# EAGLE board musical-plant (EAGLE 7.6.0)
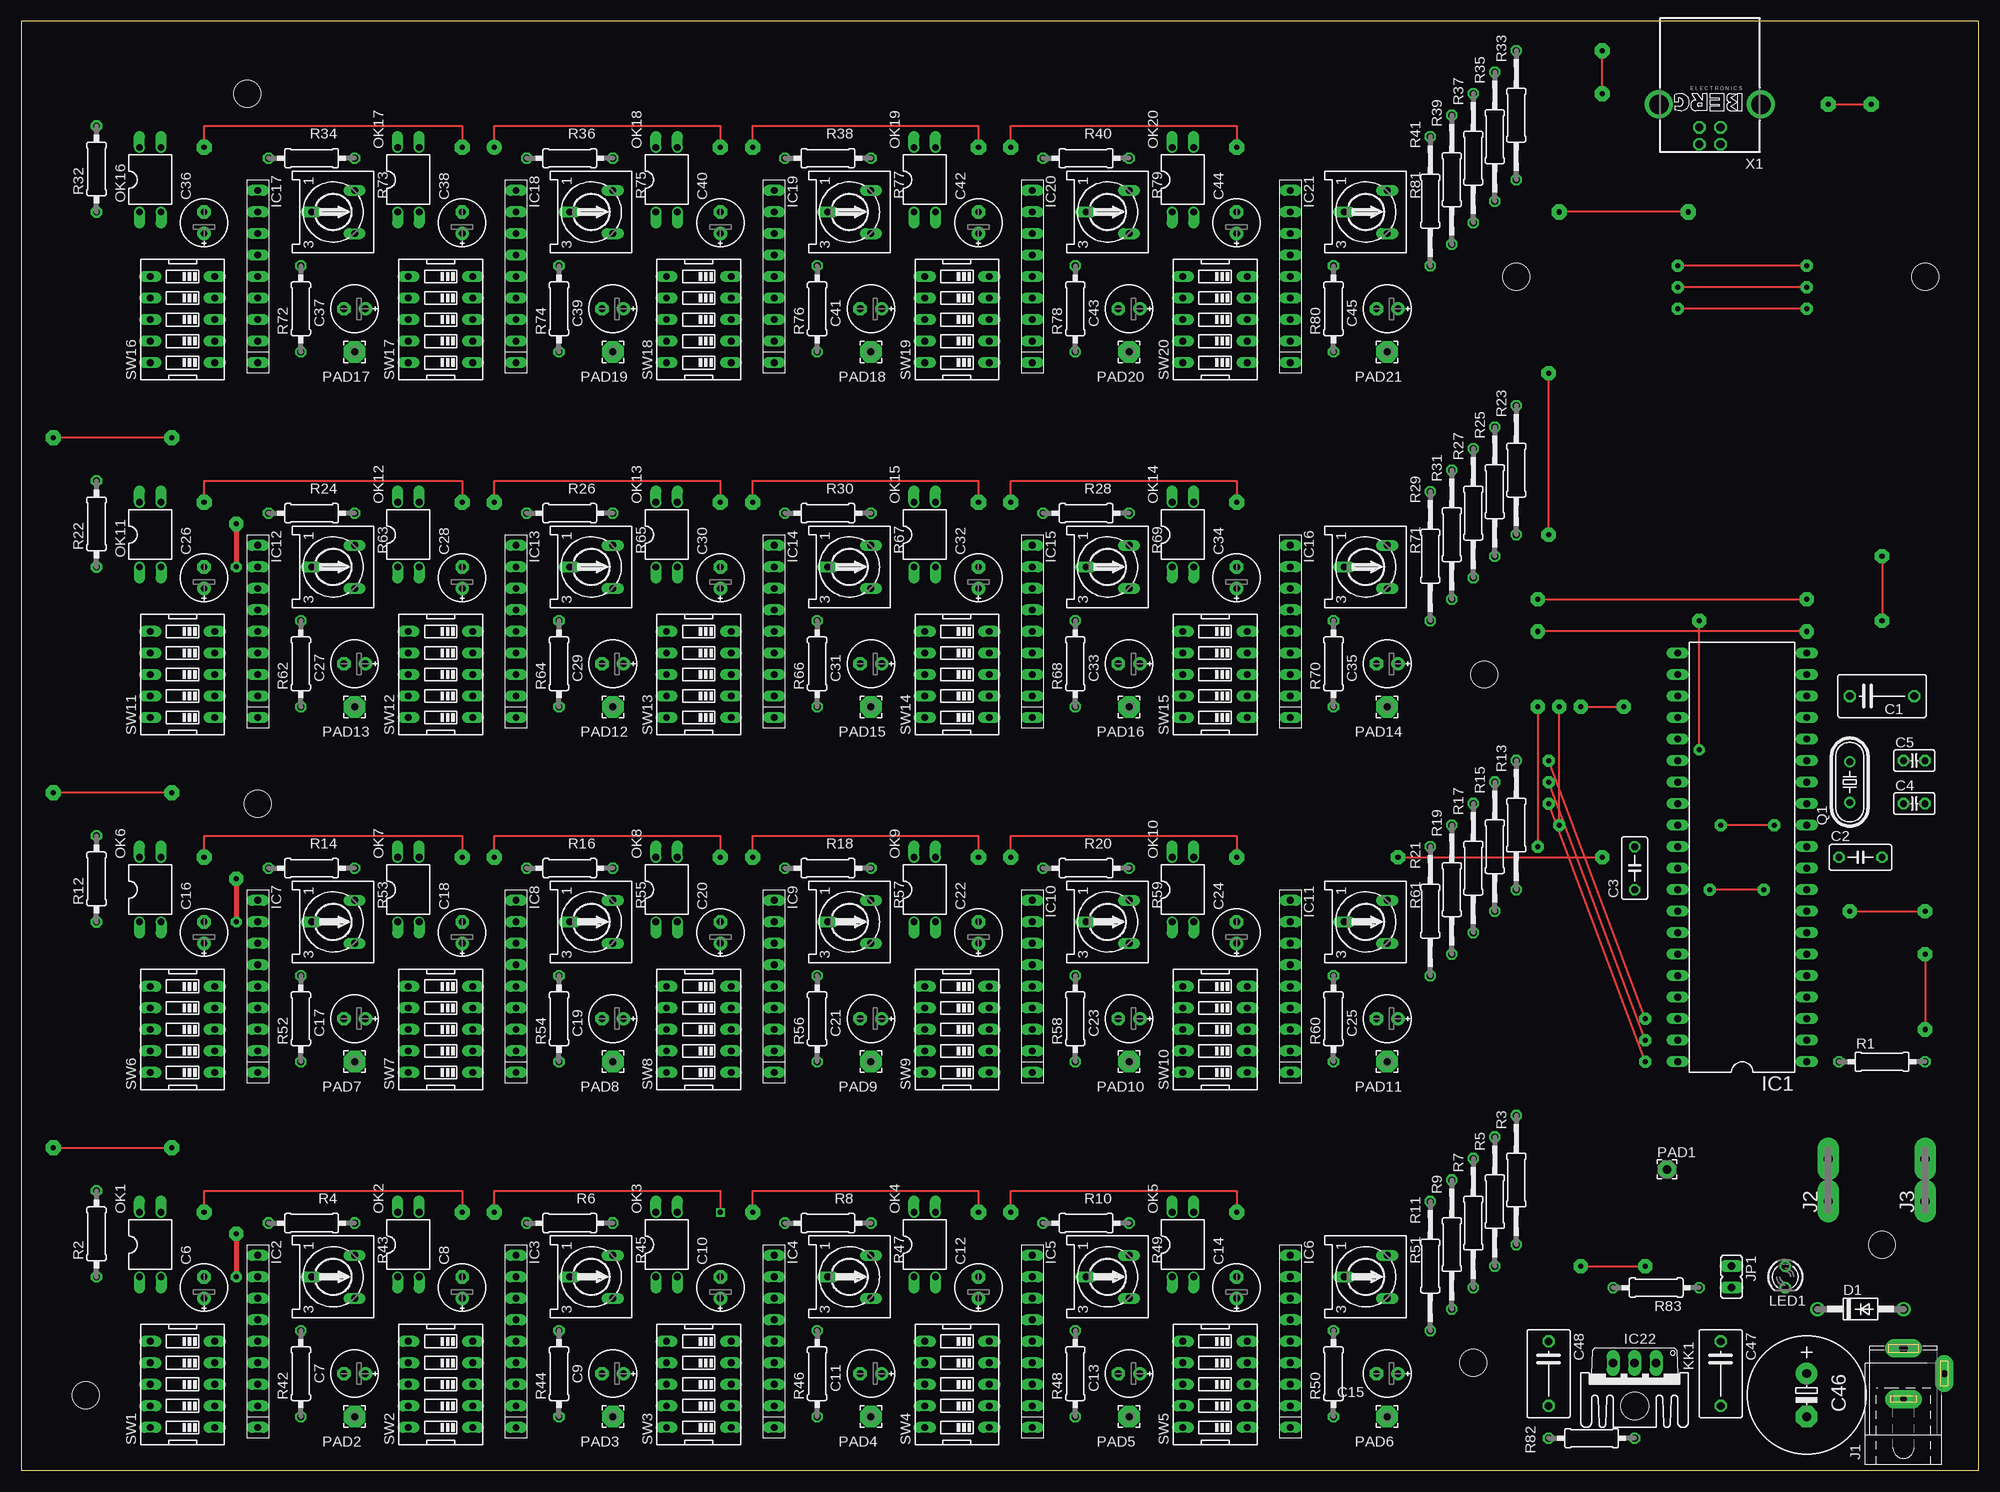
[diagram p2: board, top side]
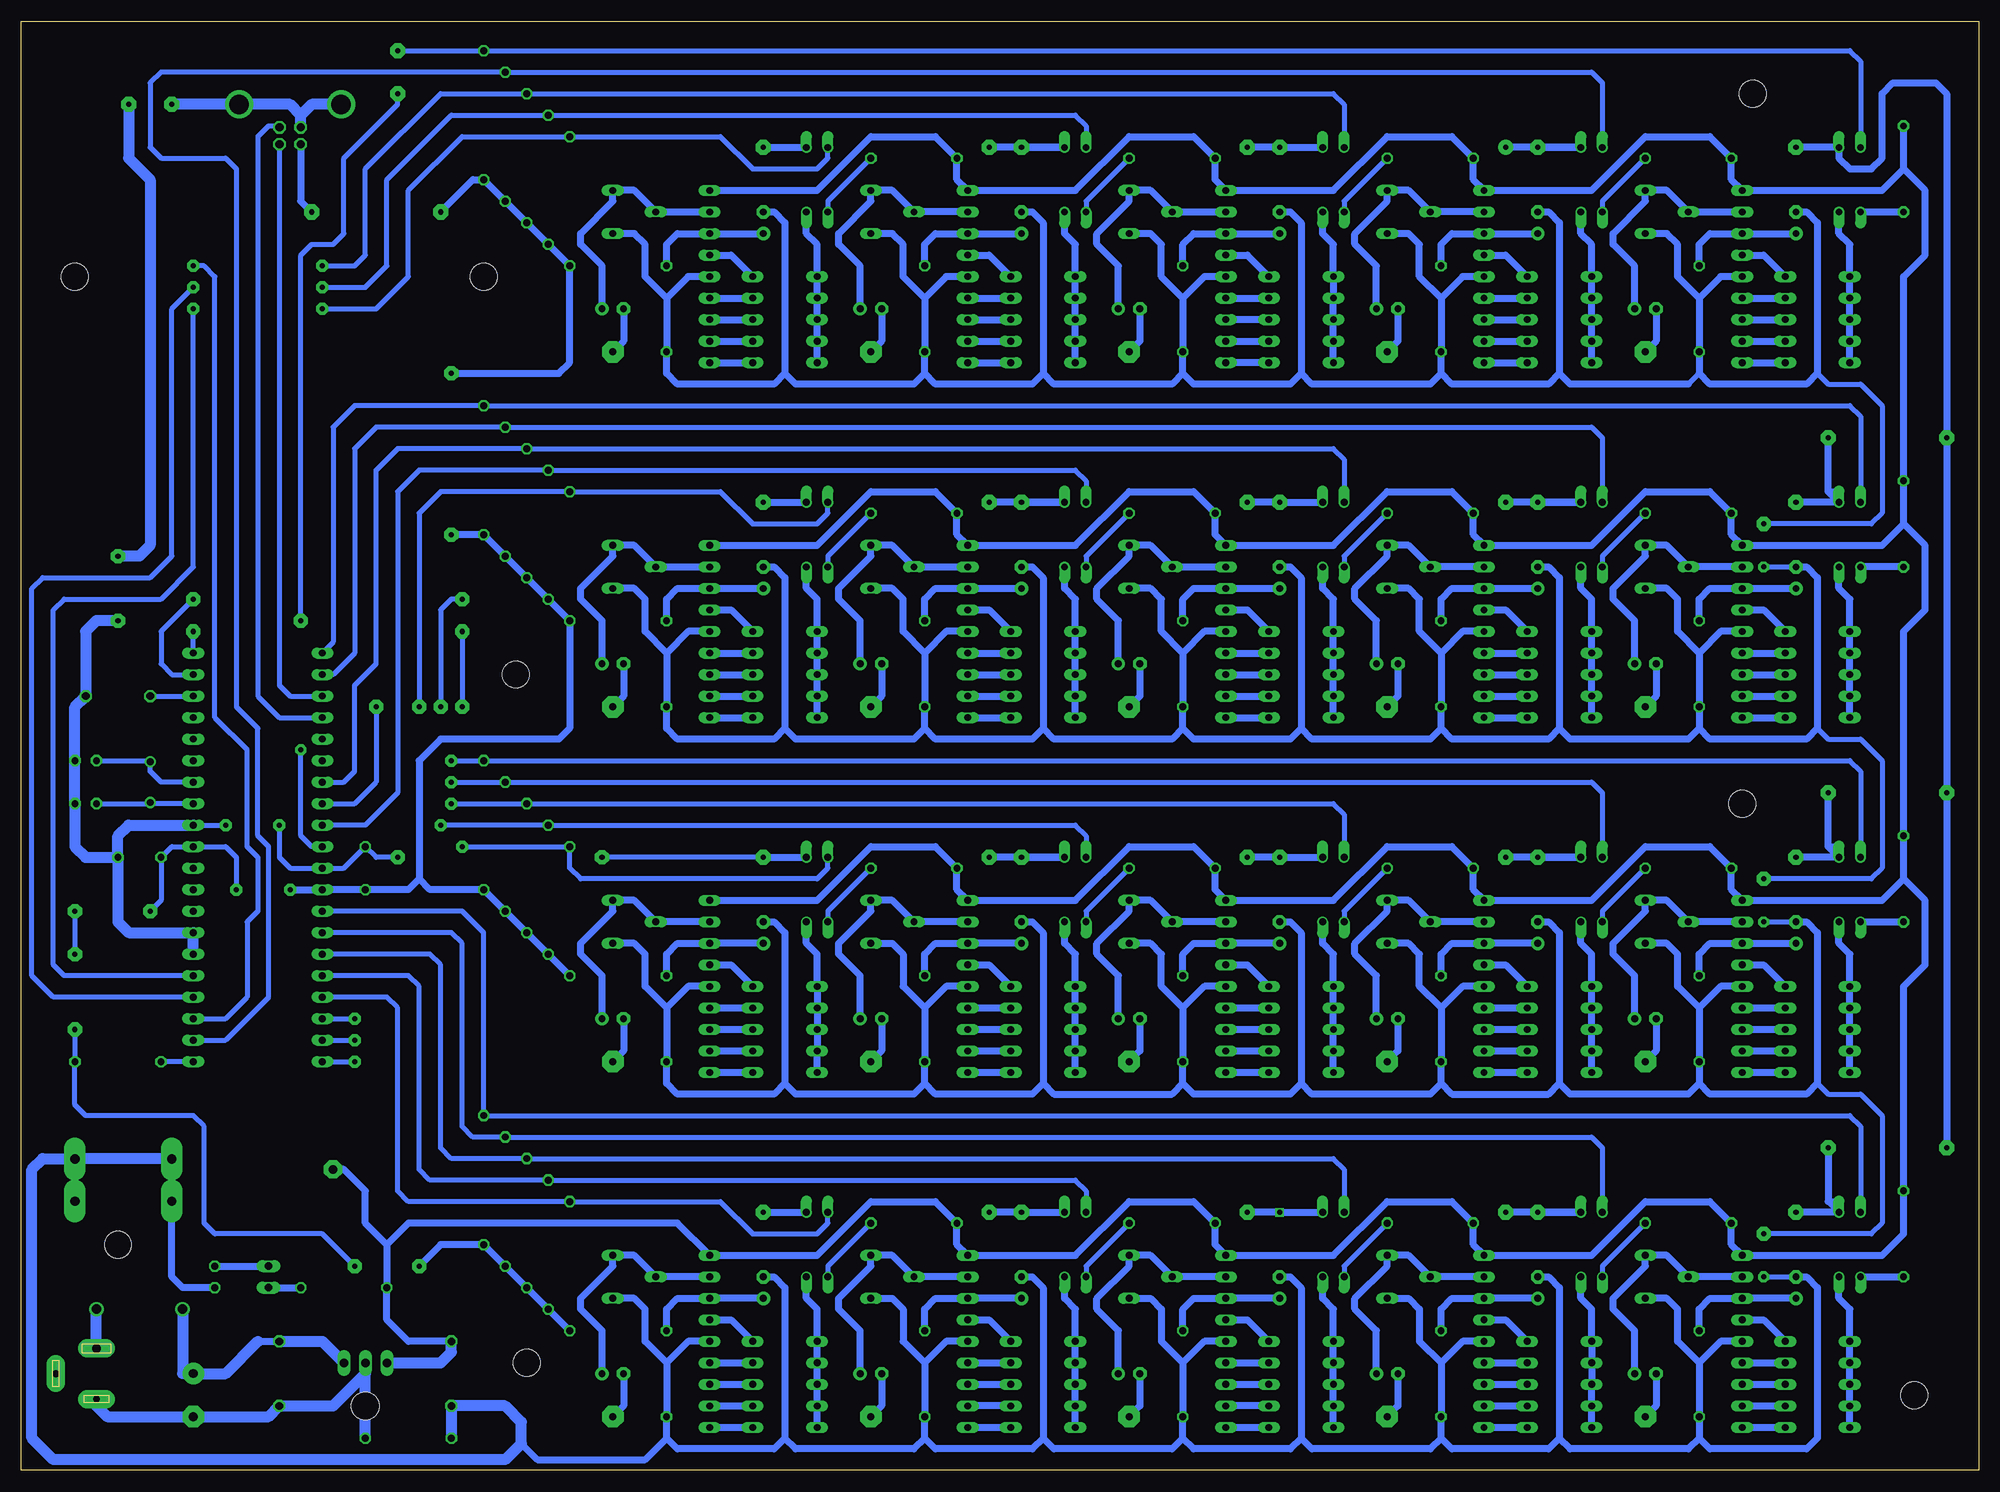
[diagram p3: board, bottom side, seen from below]

Size 231.12 x 171.12 mm. Coordinates in mm from the lower left corner, seen from the top.
Outline: 0,0 231.12,0 231.12,171.12 0,171.12 0,0
Copper layers (1*16): Top 0.035mm / dielectric 1.5mm / Bottom 0.035mm
Design rules "default": minimum track width 10mil, minimum drill 24mil, track to track 8mil, track to pad 8mil, pad to pad 8mil, via to via 8mil, smd to smd 8mil, copper to edge 40mil, drill to drill 8mil, minimum pad ring 10mil, minimum via ring 8mil, stop-mask expansion 4mil, vias tented up to drill 0mil, thermal gap 10mil
Holes 3.2 mm at 224.79,140.97 26.67,162.56 219.71,26.67 7.62,8.89 27.94,78.74 172.72,93.98 176.53,140.97 171.45,12.7

## Footprints (pad centres in the part's own frame; a part is rotated, then mirrored left to right if it is on the bottom)
C075-052X106 = drill 0.914 octagon: 1 -3.81,0; 2 3.81,0
C050-030X075 = drill 0.813 octagon: 1 -2.54,0; 2 2.54,0
C025-025X050 = drill 0.813 octagon: 1 -1.27,0; 2 1.27,0
E2,5-6E = drill 0.813 pad 1.575: + -1.27,0 | drill 0.813 pad 1.575 octagon: - 1.27,0
E5-13 = drill 1.016 pad 2.54: + -2.54,0 | drill 1.016 pad 2.54 octagon: - 2.54,0
DO41-10 = drill 1.118: A 5.08,0; C -5.08,0
DIL40 = drill 0.813 long: 1 -24.13,-7.62; 2 -21.59,-7.62; 3 -19.05,-7.62; 4 -16.51,-7.62; 5 -13.97,-7.62; 6 -11.43,-7.62; 7 -8.89,-7.62; 8 -6.35,-7.62; 9 -3.81,-7.62; 10 -1.27,-7.62; 11 1.27,-7.62; 12 3.81,-7.62; 13 6.35,-7.62; 14 8.89,-7.62; 15 11.43,-7.62; 16 13.97,-7.62; 17 16.51,-7.62; 18 19.05,-7.62; 19 21.59,-7.62; 20 24.13,-7.62; 21 24.13,7.62; 22 21.59,7.62; 23 19.05,7.62; 24 16.51,7.62; 25 13.97,7.62; 26 11.43,7.62; 27 8.89,7.62; 28 6.35,7.62; 29 3.81,7.62; 30 1.27,7.62; 31 -1.27,7.62; 32 -3.81,7.62; 33 -6.35,7.62; 34 -8.89,7.62; 35 -11.43,7.62; 36 -13.97,7.62; 37 -16.51,7.62; 38 -19.05,7.62; 39 -21.59,7.62; 40 -24.13,7.62
SIP-9 = drill 0.813 long: 1 -10.16,0; 2 -7.62,0; 3 -5.08,0; 4 -2.54,0; 5 0,0; 6 2.54,0; 7 5.08,0; 8 7.62,0; 9 10.16,0
TO220V = drill 1.016 long: 1 -2.54,-2.54; 2 0,-2.54; 3 2.54,-2.54
SPC4078 = drill 0.8 pad 2.184 long: 1 -3,0; 2 0,-4.8 | drill 1 pad 2.184 long: 3 3,0
F061.080 = drill 1.1 pad 2.54 long: 1A -2.5,0; 1B 2.5,0
JP1 = drill 0.914 long: 1 0,-1.27; 2 0,1.27
SK95-2M3 = hole 3.302: 0,2.54
LED3MM = drill 0.813 octagon: A -1.27,0; K 1.27,0
DIL04 = drill 0.813 offset: 1 -1.27,-3.81; 2 1.27,-3.81; 3 1.27,3.81; 4 -1.27,3.81
2,15/1,0 = drill 1.016 pad 2.159 octagon: 1 0,0
2,54/0,8 = drill 0.813 pad 2.54 octagon: 1 0,0
HC49/S = drill 0.813: 1 -2.413,0; 2 2.413,0
0207/10 = drill 0.813 octagon: 1 -5.08,0; 2 5.08,0
0207/15 = drill 0.813 octagon: 1 -7.62,0; 2 7.62,0
RS3 = drill 0.813 long: A -2.54,2.54; E 2.54,2.54; S 0,-2.54
EDG-05 = drill 0.813 long: 1 -5.08,-3.81; 2 -2.54,-3.81; 3 0,-3.81; 4 2.54,-3.81; 5 5.08,-3.81; 6 5.08,3.81; 7 2.54,3.81; 8 0,3.81; 9 -2.54,3.81; 10 -5.08,3.81
PN61729-S = drill 0.95 octagon: 1 1.25,4.71; 2 -1.25,4.71; 3 -1.25,2.71; 4 1.25,2.71 | drill 2.3 pad 2.9: S1 -6.02,0; S2 6.02,0

## Placement (x,y rotation side)
C1  0.22MFD/25V  [C075-052X106]  219.71,91.44 0 top
C2  0.1MFD/16V  [C050-030X075]  217.17,72.39 0 top
C3  0.1MFD/16V  [C050-030X075]  190.5,71.12 90 top
C4  15pF  [C025-025X050]  223.52,78.74 0 top
C5  15pF  [C025-025X050]  223.52,83.82 0 top
C6  10MFD/16V  [E2,5-6E]  21.59,21.59 90 top
C7  2.2MFD/16V  [E2,5-6E]  39.37,11.43 180 top
C8  10MFD/16V  [E2,5-6E]  52.07,21.59 90 top
C9  2.2MFD/16V  [E2,5-6E]  69.85,11.43 180 top
C10  10MFD/16V  [E2,5-6E]  82.55,21.59 90 top
C11  2.2MFD/16V  [E2,5-6E]  100.33,11.43 180 top
C12  10MFD/16V  [E2,5-6E]  113.03,21.59 90 top
C13  2.2MFD/16V  [E2,5-6E]  130.81,11.43 180 top
C14  10MFD/16V  [E2,5-6E]  143.51,21.59 90 top
C15  2.2MFD/16V  [E2,5-6E]  161.29,11.43 180 top
C16  10MFD/16V  [E2,5-6E]  21.59,63.5 90 top
C17  2.2MFD/16V  [E2,5-6E]  39.37,53.34 180 top
C18  10MFD/16V  [E2,5-6E]  52.07,63.5 90 top
C19  2.2MFD/16V  [E2,5-6E]  69.85,53.34 180 top
C20  10MFD/16V  [E2,5-6E]  82.55,63.5 90 top
C21  2.2MFD/16V  [E2,5-6E]  100.33,53.34 180 top
C22  10MFD/16V  [E2,5-6E]  113.03,63.5 90 top
C23  2.2MFD/16V  [E2,5-6E]  130.81,53.34 180 top
C24  10MFD/16V  [E2,5-6E]  143.51,63.5 90 top
C25  2.2MFD/16V  [E2,5-6E]  161.29,53.34 180 top
C26  10MFD/16V  [E2,5-6E]  21.59,105.41 90 top
C27  2.2MFD/16V  [E2,5-6E]  39.37,95.25 180 top
C28  10MFD/16V  [E2,5-6E]  52.07,105.41 90 top
C29  2.2MFD/16V  [E2,5-6E]  69.85,95.25 180 top
C30  10MFD/16V  [E2,5-6E]  82.55,105.41 90 top
C31  2.2MFD/16V  [E2,5-6E]  100.33,95.25 180 top
C32  10MFD/16V  [E2,5-6E]  113.03,105.41 90 top
C33  2.2MFD/16V  [E2,5-6E]  130.81,95.25 180 top
C34  10MFD/16V  [E2,5-6E]  143.51,105.41 90 top
C35  2.2MFD/16V  [E2,5-6E]  161.29,95.25 180 top
C36  10MFD/16V  [E2,5-6E]  21.59,147.32 90 top
C37  2.2MFD/16V  [E2,5-6E]  39.37,137.16 180 top
C38  10MFD/16V  [E2,5-6E]  52.07,147.32 90 top
C39  2.2MFD/16V  [E2,5-6E]  69.85,137.16 180 top
C40  10MFD/16V  [E2,5-6E]  82.55,147.32 90 top
C41  2.2MFD/16V  [E2,5-6E]  100.33,137.16 180 top
C42  10MFD/16V  [E2,5-6E]  113.03,147.32 90 top
C43  2.2MFD/16V  [E2,5-6E]  130.81,137.16 180 top
C44  10MFD/16V  [E2,5-6E]  143.51,147.32 90 top
C45  2.2MFD/16V  [E2,5-6E]  161.29,137.16 180 top
C46  1000MFD/25V  [E5-13]  210.82,8.89 270 top
C47  0.1MFD/25V  [C075-052X106]  200.66,11.43 270 top
C48  0.1MFD/25V  [C075-052X106]  180.34,11.43 270 top
D1  1N4004  [DO41-10]  217.17,19.05 0 top
IC1  PIC18F4550  [DIL40]  203.2,72.39 90 top
IC2  KA2284  [SIP-9]  27.94,15.24 90 top
IC3  KA2284  [SIP-9]  58.42,15.24 90 top
IC4  KA2284  [SIP-9]  88.9,15.24 90 top
IC5  KA2284  [SIP-9]  119.38,15.24 90 top
IC6  KA2284  [SIP-9]  149.86,15.24 90 top
IC7  KA2284  [SIP-9]  27.94,57.15 90 top
IC8  KA2284  [SIP-9]  58.42,57.15 90 top
IC9  KA2284  [SIP-9]  88.9,57.15 90 top
IC10  KA2284  [SIP-9]  119.38,57.15 90 top
IC11  KA2284  [SIP-9]  149.86,57.15 90 top
IC12  KA2284  [SIP-9]  27.94,99.06 90 top
IC13  KA2284  [SIP-9]  58.42,99.06 90 top
IC14  KA2284  [SIP-9]  88.9,99.06 90 top
IC15  KA2284  [SIP-9]  119.38,99.06 90 top
IC16  KA2284  [SIP-9]  149.86,99.06 90 top
IC17  KA2284  [SIP-9]  27.94,140.97 90 top
IC18  KA2284  [SIP-9]  58.42,140.97 90 top
IC19  KA2284  [SIP-9]  88.9,140.97 90 top
IC20  KA2284  [SIP-9]  119.38,140.97 90 top
IC21  KA2284  [SIP-9]  149.86,140.97 90 top
IC22  7809TV  [TO220V]  190.5,10.16 180 top
J1  DC-IN  [SPC4078]  222.25,11.43 90 top
J2  GND-PIN1  [F061.080]  213.36,34.29 90 top
J3  GND-PIN2  [F061.080]  224.79,34.29 90 top
JP1  [JP1]  201.93,22.86 180 top
KK1  SK95-2M3  [SK95-2M3]  190.5,10.16 180 top
LED1  POWER-IND  [LED3MM]  208.28,22.86 270 top
OK1  PC817  [DIL04]  15.24,26.67 0 top
OK2  PC817  [DIL04]  45.72,26.67 0 top
OK3  PC817  [DIL04]  76.2,26.67 0 top
OK4  PC817  [DIL04]  106.68,26.67 0 top
OK5  PC817  [DIL04]  137.16,26.67 0 top
OK6  PC817  [DIL04]  15.24,68.58 0 top
OK7  PC817  [DIL04]  45.72,68.58 0 top
OK8  PC817  [DIL04]  76.2,68.58 0 top
OK9  PC817  [DIL04]  106.68,68.58 0 top
OK10  PC817  [DIL04]  137.16,68.58 0 top
OK11  PC817  [DIL04]  15.24,110.49 0 top
OK12  PC817  [DIL04]  45.72,110.49 0 top
OK13  PC817  [DIL04]  76.2,110.49 0 top
OK14  PC817  [DIL04]  137.16,110.49 0 top
OK15  PC817  [DIL04]  106.68,110.49 0 top
OK16  PC817  [DIL04]  15.24,152.4 0 top
OK17  PC817  [DIL04]  45.72,152.4 0 top
OK18  PC817  [DIL04]  76.2,152.4 0 top
OK19  PC817  [DIL04]  106.68,152.4 0 top
OK20  PC817  [DIL04]  137.16,152.4 0 top
PAD1  TP-9V  [2,15/1,0]  194.31,35.56 0 top
PAD2  WIREPAD2,54/0,8  [2,54/0,8]  39.37,6.35 0 top
PAD3  WIREPAD2,54/0,8  [2,54/0,8]  69.85,6.35 0 top
PAD4  WIREPAD2,54/0,8  [2,54/0,8]  100.33,6.35 0 top
PAD5  WIREPAD2,54/0,8  [2,54/0,8]  130.81,6.35 0 top
PAD6  WIREPAD2,54/0,8  [2,54/0,8]  161.29,6.35 0 top
PAD7  WIREPAD2,54/0,8  [2,54/0,8]  39.37,48.26 0 top
PAD8  WIREPAD2,54/0,8  [2,54/0,8]  69.85,48.26 0 top
PAD9  WIREPAD2,54/0,8  [2,54/0,8]  100.33,48.26 0 top
PAD10  WIREPAD2,54/0,8  [2,54/0,8]  130.81,48.26 0 top
PAD11  WIREPAD2,54/0,8  [2,54/0,8]  161.29,48.26 0 top
PAD12  WIREPAD2,54/0,8  [2,54/0,8]  69.85,90.17 0 top
PAD13  WIREPAD2,54/0,8  [2,54/0,8]  39.37,90.17 0 top
PAD14  WIREPAD2,54/0,8  [2,54/0,8]  161.29,90.17 0 top
PAD15  WIREPAD2,54/0,8  [2,54/0,8]  100.33,90.17 0 top
PAD16  WIREPAD2,54/0,8  [2,54/0,8]  130.81,90.17 0 top
PAD17  WIREPAD2,54/0,8  [2,54/0,8]  39.37,132.08 0 top
PAD18  WIREPAD2,54/0,8  [2,54/0,8]  100.33,132.08 0 top
PAD19  WIREPAD2,54/0,8  [2,54/0,8]  69.85,132.08 0 top
PAD20  WIREPAD2,54/0,8  [2,54/0,8]  130.81,132.08 0 top
PAD21  WIREPAD2,54/0,8  [2,54/0,8]  161.29,132.08 0 top
Q1  20.000MHz  [HC49/S]  215.9,81.28 90 top
R1  22K  [0207/10]  219.71,48.26 0 top
R2  1K  [0207/10]  8.89,27.94 90 top
R3  22K  [0207/15]  176.53,34.29 270 top
R4  1K  [0207/10]  34.29,29.21 180 top
R5  22K  [0207/15]  173.99,31.75 270 top
R6  1K  [0207/10]  64.77,29.21 180 top
R7  22K  [0207/15]  171.45,29.21 270 top
R8  1K  [0207/10]  95.25,29.21 180 top
R9  22K  [0207/15]  168.91,26.67 270 top
R10  1K  [0207/10]  125.73,29.21 180 top
R11  22K  [0207/15]  166.37,24.13 270 top
R12  1K  [0207/10]  8.89,69.85 90 top
R13  22K  [0207/15]  176.53,76.2 270 top
R14  1K  [0207/10]  34.29,71.12 180 top
R15  22K  [0207/15]  173.99,73.66 270 top
R16  1K  [0207/10]  64.77,71.12 180 top
R17  22K  [0207/15]  171.45,71.12 270 top
R18  1K  [0207/10]  95.25,71.12 180 top
R19  22K  [0207/15]  168.91,68.58 270 top
R20  1K  [0207/10]  125.73,71.12 180 top
R21  22K  [0207/15]  166.37,66.04 270 top
R22  1K  [0207/10]  8.89,111.76 90 top
R23  22K  [0207/15]  176.53,118.11 270 top
R24  1K  [0207/10]  34.29,113.03 180 top
R25  22K  [0207/15]  173.99,115.57 270 top
R26  1K  [0207/10]  64.77,113.03 180 top
R27  22K  [0207/15]  171.45,113.03 270 top
R28  1K  [0207/10]  125.73,113.03 180 top
R29  22K  [0207/15]  166.37,107.95 270 top
R30  1K  [0207/10]  95.25,113.03 180 top
R31  22K  [0207/15]  168.91,110.49 270 top
R32  1K  [0207/10]  8.89,153.67 90 top
R33  22K  [0207/15]  176.53,160.02 270 top
R34  1K  [0207/10]  34.29,154.94 180 top
R35  22K  [0207/15]  173.99,157.48 270 top
R36  1K  [0207/10]  64.77,154.94 180 top
R37  22K  [0207/15]  171.45,154.94 270 top
R38  1K  [0207/10]  95.25,154.94 180 top
R39  22K  [0207/15]  168.91,152.4 270 top
R40  1K  [0207/10]  125.73,154.94 180 top
R41  22K  [0207/15]  166.37,149.86 270 top
R42  10K  [0207/10]  33.02,11.43 90 top
R43  470K  [RS3]  36.83,22.86 270 top
R44  10K  [0207/10]  63.5,11.43 90 top
R45  470K  [RS3]  67.31,22.86 270 top
R46  10K  [0207/10]  93.98,11.43 90 top
R47  470K  [RS3]  97.79,22.86 270 top
R48  10K  [0207/10]  124.46,11.43 90 top
R49  470K  [RS3]  128.27,22.86 270 top
R50  10K  [0207/10]  154.94,11.43 90 top
R51  470K  [RS3]  158.75,22.86 270 top
R52  10K  [0207/10]  33.02,53.34 90 top
R53  470K  [RS3]  36.83,64.77 270 top
R54  10K  [0207/10]  63.5,53.34 90 top
R55  470K  [RS3]  67.31,64.77 270 top
R56  10K  [0207/10]  93.98,53.34 90 top
R57  470K  [RS3]  97.79,64.77 270 top
R58  10K  [0207/10]  124.46,53.34 90 top
R59  470K  [RS3]  128.27,64.77 270 top
R60  10K  [0207/10]  154.94,53.34 90 top
R61  470K  [RS3]  158.75,64.77 270 top
R62  10K  [0207/10]  33.02,95.25 90 top
R63  470K  [RS3]  36.83,106.68 270 top
R64  10K  [0207/10]  63.5,95.25 90 top
R65  470K  [RS3]  67.31,106.68 270 top
R66  10K  [0207/10]  93.98,95.25 90 top
R67  470K  [RS3]  97.79,106.68 270 top
R68  10K  [0207/10]  124.46,95.25 90 top
R69  470K  [RS3]  128.27,106.68 270 top
R70  10K  [0207/10]  154.94,95.25 90 top
R71  470K  [RS3]  158.75,106.68 270 top
R72  10K  [0207/10]  33.02,137.16 90 top
R73  470K  [RS3]  36.83,148.59 270 top
R74  10K  [0207/10]  63.5,137.16 90 top
R75  470K  [RS3]  67.31,148.59 270 top
R76  10K  [0207/10]  93.98,137.16 90 top
R77  470K  [RS3]  97.79,148.59 270 top
R78  10K  [0207/10]  124.46,137.16 90 top
R79  470K  [RS3]  128.27,148.59 270 top
R80  10K  [0207/10]  154.94,137.16 90 top
R81  470K  [RS3]  158.75,148.59 270 top
R82  0R  [0207/10]  185.42,3.81 0 top
R83  1K  [0207/10]  193.04,21.59 180 top
SW1  [EDG-05]  19.05,10.16 90 top
SW2  [EDG-05]  49.53,10.16 90 top
SW3  [EDG-05]  80.01,10.16 90 top
SW4  [EDG-05]  110.49,10.16 90 top
SW5  [EDG-05]  140.97,10.16 90 top
SW6  [EDG-05]  19.05,52.07 90 top
SW7  [EDG-05]  49.53,52.07 90 top
SW8  [EDG-05]  80.01,52.07 90 top
SW9  [EDG-05]  110.49,52.07 90 top
SW10  [EDG-05]  140.97,52.07 90 top
SW11  [EDG-05]  19.05,93.98 90 top
SW12  [EDG-05]  49.53,93.98 90 top
SW13  [EDG-05]  80.01,93.98 90 top
SW14  [EDG-05]  110.49,93.98 90 top
SW15  [EDG-05]  140.97,93.98 90 top
SW16  [EDG-05]  19.05,135.89 90 top
SW17  [EDG-05]  49.53,135.89 90 top
SW18  [EDG-05]  80.01,135.89 90 top
SW19  [EDG-05]  110.49,135.89 90 top
SW20  [EDG-05]  140.97,135.89 90 top
X1  PN61729-S  [PN61729-S]  199.39,161.29 180 top

## Tracks (layer width: path | path; a pad name or v marks a point on that pad's centre or on a via)
+5V  (via drill 0.6 pad 1.42, 0.6 pad 1.68, 0.6 pad 1.78)
  Top 0.254: v215.9,66.04 v224.79,66.04 | v224.79,60.96 v224.79,52.07 | v205.74,68.58 v199.39,68.58 | v180.34,110.49 v180.34,129.54 | v184.15,24.13 v191.77,24.13 | v196.85,148.59 v181.61,148.59
  Bottom 0.61: v215.9,66.04 214.63,67.31 C2.1 213.36,73.66 IC1.11 207.01,73.66 205.74,72.39 v205.74,68.58 | v224.79,66.04 v224.79,60.96 | v224.79,52.07 R1.2 224.79,43.18 223.52,41.91 210.82,41.91 209.55,40.64 209.55,29.21 208.28,27.94 195.58,27.94 v191.77,24.13
  Bottom 0.813: R21.2 R19.2 R17.2 R15.2 R13.2 182.88,68.58 184.15,69.85 | R11.2 R9.2 R7.2 R5.2 R3.2 181.61,26.67 v184.15,24.13 | v199.39,68.58 IC1.32 C3.1 185.42,68.58 184.15,69.85 | 184.15,69.85 184.15,83.82 181.61,86.36 167.64,86.36 166.37,87.63 R29.2 R31.2 R27.2 R25.2 R23.2 v180.34,110.49 | v180.34,129.54 167.64,129.54 166.37,130.81 R41.2 R39.2 R37.2 R35.2 R33.2 177.8,152.4 v181.61,148.59 | X1.1 198.14,149.88 v196.85,148.59
+9V
  Bottom 0.813: IC11.9 137.16,67.31 130.81,73.66 123.19,73.66 R20.2 120.65,68.58 IC10.9 106.68,67.31 100.33,73.66 92.71,73.66 R18.2 90.17,68.58 IC9.9 76.2,67.31 69.85,73.66 62.23,73.66 R16.2 59.69,68.58 IC8.9 45.72,67.31 39.37,73.66 31.75,73.66 R14.2 29.21,68.58 IC7.9 11.43,67.31 8.89,69.85 | IC16.9 137.16,109.22 130.81,115.57 123.19,115.57 R28.2 120.65,110.49 IC15.9 106.68,109.22 100.33,115.57 92.71,115.57 R30.2 90.17,110.49 IC14.9 76.2,109.22 69.85,115.57 62.23,115.57 R26.2 59.69,110.49 IC13.9 45.72,109.22 39.37,115.57 31.75,115.57 R24.2 29.21,110.49 IC12.9 11.43,109.22 8.89,111.76 | IC21.9 137.16,151.13 130.81,157.48 123.19,157.48 R40.2 120.65,152.4 IC20.9 106.68,151.13 100.33,157.48 92.71,157.48 R38.2 90.17,152.4 IC19.9 76.2,151.13 69.85,157.48 62.23,157.48 R36.2 59.69,152.4 IC18.9 45.72,151.13 39.37,157.48 31.75,157.48 R34.2 29.21,152.4 IC17.9 11.43,151.13 8.89,153.67 | 8.89,69.85 R12.2 8.89,99.06 6.35,101.6 6.35,109.22 8.89,111.76 | 8.89,111.76 R22.2 8.89,140.97 6.35,143.51 6.35,151.13 8.89,153.67 | 8.89,153.67 R32.2 | 8.89,69.85 6.35,67.31 6.35,59.69 8.89,57.15 R2.2 8.89,27.94 11.43,25.4 IC2.9 29.21,26.67 R4.2 31.75,31.75 39.37,31.75 45.72,25.4 IC3.9 59.69,26.67 R6.2 62.23,31.75 69.85,31.75 76.2,25.4 IC4.9 90.17,26.67 R8.2 92.71,31.75 100.33,31.75 106.68,25.4 IC5.9 120.65,26.67 R10.2 123.19,31.75 130.81,31.75 137.16,25.4 IC6.9 153.67,29.21 185.42,29.21 187.96,26.67 | 187.96,26.67 R83.2 187.96,17.78 185.42,15.24 C48.1 | 187.96,26.67 190.5,29.21 190.5,33.02 193.04,35.56 PAD1.1
  Bottom 1.27: IC22.3 181.61,12.7 180.34,13.97 C48.1
D-MINUS
  Bottom 0.61: X1.2 200.64,92.69 199.39,91.44 IC1.23
D-PLUS
  Bottom 0.61: IC1.24 200.66,88.9 203.2,91.44 203.2,157.48 201.93,158.75 200.66,158.75 200.66,158.6 X1.3
DGND  (via drill 0.6, 0.6 pad 1.42, 0.6 pad 1.68, 0.6 pad 1.78)
  Top 0.254: v3.81,38.1 v17.78,38.1 | v17.78,80.01 v3.81,80.01 | v17.78,121.92 v3.81,121.92 | v21.59,30.48 21.59,33.02 52.07,33.02 v52.07,30.48 | v55.88,30.48 55.88,33.02 82.55,33.02 v82.55,30.48 | v86.36,30.48 86.36,33.02 113.03,33.02 v113.03,30.48 | v116.84,30.48 116.84,33.02 143.51,33.02 v143.51,30.48 | v21.59,72.39 21.59,74.93 52.07,74.93 v52.07,72.39 | v55.88,72.39 55.88,74.93 82.55,74.93 v82.55,72.39 | v86.36,72.39 86.36,74.93 113.03,74.93 v113.03,72.39 | v116.84,72.39 116.84,74.93 143.51,74.93 v143.51,72.39 | v21.59,114.3 21.59,116.84 52.07,116.84 v52.07,114.3 | v55.88,114.3 55.88,116.84 82.55,116.84 v82.55,114.3 | v86.36,114.3 86.36,116.84 113.03,116.84 v113.03,114.3 | v116.84,114.3 116.84,116.84 143.51,116.84 v143.51,114.3 | v21.59,156.21 21.59,158.75 52.07,158.75 v52.07,156.21 | v55.88,156.21 55.88,158.75 82.55,158.75 v82.55,156.21 | v86.36,156.21 86.36,158.75 113.03,158.75 v113.03,156.21 | v116.84,156.21 116.84,158.75 143.51,158.75 v143.51,156.21 | v207.01,76.2 v200.66,76.2 | v213.36,161.29 v218.44,161.29 | v219.71,107.95 v219.71,100.33 | v162.56,72.39 v186.69,72.39
  Bottom 0.61: 17.78,31.75 OK1.3 | IC1.12 v207.01,76.2 | v200.66,76.2 200.66,72.39 199.39,71.12 IC1.31 193.04,71.12 C3.2 189.23,72.39 v186.69,72.39 | v143.51,72.39 v162.56,72.39 | 198.14,160 198.12,160.02 198.14,160.04 198.14,160
  Bottom 0.813: v17.78,38.1 17.78,31.75 16.51,31.75 OK1.3 v21.59,30.48 | OK6.3 17.78,73.66 | 17.78,73.66 v17.78,80.01 | v3.81,38.1 v3.81,80.01 v3.81,121.92 3.81,162.56 5.08,163.83 10.16,163.83 11.43,162.56 11.43,154.94 12.7,153.67 15.24,153.67 16.51,154.94 OK16.3 v21.59,156.21 | OK11.3 17.78,115.57 | 17.78,115.57 v17.78,121.92 | v52.07,30.48 OK2.3 v55.88,30.48 | OK3.3 v82.55,30.48 v86.36,30.48 | OK4.3 v113.03,30.48 v116.84,30.48 | v143.51,30.48 OK5.3 | 17.78,73.66 16.51,73.66 OK6.3 | OK6.3 v21.59,72.39 | v52.07,72.39 OK7.3 v55.88,72.39 | OK8.3 v82.55,72.39 v86.36,72.39 | v113.03,72.39 OK9.3 v116.84,72.39 | v143.51,72.39 OK10.3 | 17.78,115.57 16.51,115.57 OK11.3 | OK11.3 v21.59,114.3 | v52.07,114.3 OK12.3 v55.88,114.3 | OK13.3 v82.55,114.3 v86.36,114.3 | v113.03,114.3 OK15.3 v116.84,114.3 | v143.51,114.3 OK14.3 | v52.07,156.21 OK17.3 v55.88,156.21 | OK18.3 v82.55,156.21 v86.36,156.21 | v113.03,156.21 OK19.3 v116.84,156.21 | v143.51,156.21 OK20.3
  Bottom 1.27: C2.2 223.52,72.39 224.79,73.66 C4.2 C5.2 224.79,90.17 C1.2 223.52,99.06 222.25,100.33 v219.71,100.33 | C2.2 219.71,74.93 218.44,76.2 IC1.12 | IC1.6 IC1.7 218.44,63.5 219.71,64.77 C2.2 | X1.4 198.14,160 | 198.14,160.04 199.39,161.29 X1.S1 v213.36,161.29 | X1.S2 196.85,161.29 198.12,160.02 | v218.44,161.29 218.44,154.94 215.9,152.4 215.9,109.22 217.17,107.95 v219.71,107.95
GND  (via drill 0.6 pad 1.27, 0.6 pad 1.68)
  Top 0.61: v25.4,27.94 v25.4,22.86 | v25.4,69.85 v25.4,64.77 | v25.4,111.76 v25.4,106.68
  Bottom 0.61: 19.05,45.72 17.78,44.45 13.97,44.45 11.43,41.91 11.43,29.21 12.7,27.94 v25.4,27.94 | v25.4,22.86 C6.- | 19.05,87.63 17.78,86.36 13.97,86.36 11.43,83.82 11.43,71.12 12.7,69.85 v25.4,69.85 | v25.4,64.77 C16.- | 34.29,128.27 33.02,129.54 | 19.05,129.54 17.78,128.27 13.97,128.27 11.43,125.73 11.43,113.03 12.7,111.76 v25.4,111.76 | v25.4,106.68 C26.-
  Bottom 0.813: IC2.5 30.48,15.24 33.02,12.7 | 33.02,12.7 R42.1 33.02,3.81 | 33.02,12.7 35.56,15.24 35.56,19.05 36.83,20.32 R43.E | IC3.5 60.96,15.24 63.5,12.7 | IC4.5 91.44,15.24 93.98,12.7 | IC5.5 121.92,15.24 124.46,12.7 | 154.94,12.7 R50.1 154.94,3.81 | IC6.5 152.4,15.24 154.94,12.7 | 154.94,12.7 157.48,15.24 157.48,19.05 158.75,20.32 R51.E | IC7.5 30.48,57.15 33.02,54.61 | 33.02,54.61 R52.1 33.02,45.72 | 33.02,54.61 35.56,57.15 35.56,60.96 36.83,62.23 R53.E | IC8.5 60.96,57.15 63.5,54.61 | 63.5,54.61 R54.1 63.5,45.72 | 63.5,54.61 66.04,57.15 66.04,60.96 67.31,62.23 R55.E | IC9.5 91.44,57.15 93.98,54.61 | 93.98,54.61 R56.1 93.98,45.72 | 93.98,54.61 96.52,57.15 96.52,60.96 97.79,62.23 R57.E | IC10.5 121.92,57.15 124.46,54.61 | IC11.5 152.4,57.15 154.94,54.61 | 154.94,54.61 R60.1 154.94,45.72 153.67,44.45 142.24,44.45 140.97,45.72 | 154.94,54.61 157.48,57.15 157.48,60.96 158.75,62.23 R61.E | 33.02,96.52 R62.1 33.02,87.63 | IC12.5 30.48,99.06 33.02,96.52 | 33.02,96.52 35.56,99.06 35.56,102.87 36.83,104.14 R63.E | IC13.5 60.96,99.06 63.5,96.52 | 63.5,96.52 R64.1 63.5,87.63 | 63.5,96.52 66.04,99.06 66.04,102.87 67.31,104.14 R65.E | IC14.5 91.44,99.06 93.98,96.52 | 93.98,96.52 R66.1 93.98,87.63 | 93.98,96.52 96.52,99.06 96.52,102.87 97.79,104.14 R67.E | IC15.5 121.92,99.06 124.46,96.52 | 124.46,96.52 R68.1 124.46,87.63 | 124.46,96.52 127,99.06 127,102.87 128.27,104.14 R69.E | IC16.5 152.4,99.06 154.94,96.52 | 154.94,96.52 R70.1 154.94,87.63 153.67,86.36 142.24,86.36 140.97,87.63 | 154.94,96.52 157.48,99.06 157.48,102.87 158.75,104.14 R71.E | IC17.5 30.48,140.97 33.02,138.43 | 33.02,138.43 R72.1 33.02,129.54 31.75,128.27 20.32,128.27 19.05,129.54 19.05,147.32 20.32,148.59 C36.-
  Bottom 0.813: 33.02,138.43 35.56,140.97 35.56,144.78 36.83,146.05 R73.E | IC18.5 60.96,140.97 63.5,138.43 | 63.5,138.43 R74.1 63.5,129.54 | 63.5,138.43 66.04,140.97 66.04,144.78 67.31,146.05 R75.E | 93.98,138.43 R76.1 93.98,129.54 | IC19.5 91.44,140.97 93.98,138.43 | 93.98,138.43 96.52,140.97 96.52,144.78 97.79,146.05 R77.E | 124.46,138.43 R78.1 124.46,129.54 | IC20.5 121.92,140.97 124.46,138.43 | 124.46,138.43 127,140.97 127,144.78 128.27,146.05 R79.E | IC21.5 152.4,140.97 154.94,138.43 | 154.94,138.43 R80.1 154.94,129.54 153.67,128.27 142.24,128.27 140.97,129.54 | 154.94,138.43 157.48,140.97 157.48,144.78 158.75,146.05 R81.E | 33.02,45.72 34.29,44.45 48.26,44.45 49.53,45.72 | 33.02,87.63 34.29,86.36 48.26,86.36 49.53,87.63 | 33.02,3.81 34.29,2.54 48.26,2.54 49.53,3.81 | 63.5,3.81 62.23,2.54 50.8,2.54 49.53,3.81 | 63.5,3.81 R44.1 63.5,12.7 | 63.5,129.54 62.23,128.27 50.8,128.27 49.53,129.54 | 63.5,129.54 64.77,128.27 78.74,128.27 80.01,129.54 | 93.98,129.54 92.71,128.27 81.28,128.27 80.01,129.54 | 93.98,129.54 95.25,128.27 109.22,128.27 110.49,129.54 | 124.46,129.54 123.19,128.27 111.76,128.27 110.49,129.54 | 124.46,129.54 125.73,128.27 139.7,128.27 140.97,129.54 | 63.5,87.63 62.23,86.36 50.8,86.36 49.53,87.63 | 63.5,87.63 64.77,86.36 78.74,86.36 80.01,87.63 | 93.98,87.63 92.71,86.36 81.28,86.36 80.01,87.63 | 93.98,87.63 95.25,86.36 109.22,86.36 110.49,87.63 | 124.46,87.63 123.19,86.36 111.76,86.36 110.49,87.63 | 124.46,87.63 125.73,86.36 139.7,86.36 140.97,87.63 | 63.5,45.72 62.23,44.45 50.8,44.45 49.53,45.72 | 63.5,45.72 64.77,44.45 78.74,44.45 80.01,45.72 | 93.98,45.72 92.71,44.45 81.28,44.45 80.01,45.72
  Bottom 0.813: 93.98,45.72 95.25,44.45 109.22,44.45 110.49,45.72 | 124.46,45.72 R58.1 124.46,54.61 | 124.46,45.72 123.19,44.45 111.76,44.45 110.49,45.72 | R45.E 67.31,20.32 66.04,19.05 66.04,15.24 63.5,12.7 | 63.5,3.81 64.77,2.54 78.74,2.54 80.01,3.81 | 93.98,3.81 92.71,2.54 81.28,2.54 80.01,3.81 | 93.98,3.81 R46.1 93.98,12.7 | R47.E 97.79,20.32 96.52,19.05 96.52,15.24 93.98,12.7 | 93.98,3.81 95.25,2.54 109.22,2.54 110.49,3.81 | 124.46,3.81 123.19,2.54 111.76,2.54 110.49,3.81 | 124.46,3.81 R48.1 124.46,12.7 | R49.E 128.27,20.32 127,19.05 127,15.24 124.46,12.7 | 124.46,3.81 125.73,2.54 139.7,2.54 140.97,3.81 | 154.94,3.81 153.67,2.54 142.24,2.54 140.97,3.81 | C18.- 50.8,64.77 49.53,63.5 49.53,45.72 | C16.- 20.32,64.77 19.05,63.5 19.05,45.72 20.32,44.45 31.75,44.45 33.02,45.72 | C20.- 81.28,64.77 80.01,63.5 80.01,45.72 | C22.- 111.76,64.77 110.49,63.5 110.49,45.72 | C24.- 142.24,64.77 140.97,63.5 140.97,45.72 | R59.E 128.27,62.23 127,60.96 127,57.15 124.46,54.61 | 124.46,45.72 125.73,44.45 139.7,44.45 140.97,45.72 | C6.- 20.32,22.86 19.05,21.59 19.05,3.81 20.32,2.54 31.75,2.54 33.02,3.81 | C8.- 50.8,22.86 49.53,21.59 49.53,3.81 | C10.- 81.28,22.86 80.01,21.59 80.01,3.81 | C12.- 111.76,22.86 110.49,21.59 110.49,3.81 | C14.- 142.24,22.86 140.97,21.59 140.97,3.81 | C26.- 20.32,106.68 19.05,105.41 19.05,87.63 20.32,86.36 31.75,86.36 33.02,87.63 | C28.- 50.8,106.68 49.53,105.41 49.53,87.63 | C30.- 81.28,106.68 80.01,105.41 80.01,87.63 | C32.- 111.76,106.68 110.49,105.41 110.49,87.63 | C34.- 142.24,106.68 140.97,105.41 140.97,87.63 | C38.- 50.8,148.59 49.53,147.32 49.53,129.54 | 34.29,128.27 48.26,128.27 49.53,129.54
  Bottom 0.813: C40.- 81.28,148.59 80.01,147.32 80.01,129.54 | C42.- 111.76,148.59 110.49,147.32 110.49,129.54 | C44.- 142.24,148.59 140.97,147.32 140.97,129.54 | 154.94,3.81 157.48,1.27 170.18,1.27 172.09,3.18 | 213.36,30.48 J2.1A | 224.79,30.48 J3.1A J3.1B 224.83,36.83 | J2.1B J2.1A | LED1.K 212.09,21.59 213.36,22.86 J2.1A
  Bottom 1.27: J2.1B J3.1B | R82.1 C48.2 173.99,7.62 172.09,5.71 172.09,3.18 173.99,1.27 227.33,1.27 229.87,3.81 229.87,35.56 228.6,36.83 224.83,36.83
IN0
  Bottom 0.61: OK1.4 13.97,40.64 15.24,41.91 R3.1 176.53,63.5 179.07,66.04 IC1.33
IN1
  Bottom 0.61: OK2.4 44.45,38.1 45.72,39.37 R5.1 177.8,39.37 179.07,40.64 179.07,62.23 180.34,63.5 IC1.34
IN2
  Bottom 0.61: OK3.4 74.93,35.56 76.2,36.83 R7.1 180.34,36.83 181.61,38.1 181.61,59.69 182.88,60.96 IC1.35
IN3
  Bottom 0.61: OK4.4 105.41,33.02 106.68,34.29 R9.1 182.88,34.29 184.15,35.56 184.15,57.15 185.42,58.42 IC1.36
IN4
  Bottom 0.61: 135.89,31.75 OK5.4 135.89,29.21 137.16,27.94 144.78,27.94 148.59,31.75 R11.1 185.42,31.75 186.69,33.02 186.69,54.61 187.96,55.88 IC1.37
IN5  (via drill 0.6 pad 1.42)
  Top 0.254: v191.77,53.34 v180.34,83.82
  Bottom 0.61: OK6.4 13.97,82.55 15.24,83.82 R13.1 v180.34,83.82 | IC1.38 v191.77,53.34
IN6  (via drill 0.6 pad 1.42)
  Top 0.254: v191.77,50.8 v180.34,81.28
  Bottom 0.61: OK7.4 44.45,80.01 45.72,81.28 R15.1 v180.34,81.28 | IC1.39 v191.77,50.8
IN7  (via drill 0.6 pad 1.42)
  Top 0.254: v191.77,48.26 v180.34,78.74
  Bottom 0.61: OK8.4 74.93,77.47 76.2,78.74 R17.1 v180.34,78.74 | IC1.40 v191.77,48.26
IN8  (via drill 0.6 pad 1.42, 0.6 pad 1.68)
  Top 0.254: v181.61,76.2 v181.61,90.17 | v179.07,102.87 v210.82,102.87
  Bottom 0.61: OK9.4 105.41,74.93 106.68,76.2 R19.1 v181.61,76.2 | v210.82,102.87 214.63,99.06 214.63,95.25 213.36,93.98 IC1.19 | v179.07,102.87 180.34,102.87 181.61,101.6 v181.61,90.17
IN9  (via drill 0.6 pad 1.42, 0.6 pad 1.68)
  Top 0.254: v210.82,99.06 v179.07,99.06 | v179.07,90.17 v179.07,73.66
  Bottom 0.61: OK10.4 135.89,71.12 137.16,69.85 165.1,69.85 166.37,71.12 R21.1 v179.07,73.66 | IC1.20 v210.82,99.06 | v179.07,99.06 v179.07,90.17
IN10
  Bottom 0.61: OK11.4 13.97,124.46 15.24,125.73 R23.1 191.77,125.73 194.31,123.19 194.31,97.79 IC1.21
IN11
  Bottom 0.61: OK12.4 44.45,121.92 45.72,123.19 R25.1 189.23,123.19 191.77,120.65 191.77,96.52 194.31,93.98 IC1.22
IN12
  Bottom 0.61: OK13.4 74.93,119.38 76.2,120.65 R27.1 186.69,120.65 189.23,118.11 189.23,95.25 191.77,92.71 191.77,82.55 193.04,81.28 IC1.27
IN13  (via drill 0.6 pad 1.68)
  Top 0.254: v184.15,90.17 v189.23,90.17
  Bottom 0.61: OK14.4 135.89,113.03 137.16,111.76 144.78,111.76 148.59,115.57 R29.1 181.61,115.57 184.15,113.03 v184.15,90.17 | IC1.28 191.77,78.74 189.23,81.28 v189.23,90.17
IN14
  Bottom 0.61: OK15.4 105.41,116.84 106.68,118.11 R31.1 184.15,118.11 186.69,115.57 186.69,80.01 190.5,76.2 IC1.29
IN15  (via drill 0.6 pad 1.27, 0.6 pad 1.68, 0.6 pad 1.78)
  Top 0.254: v198.12,85.09 v198.12,100.33 | v186.69,162.56 v186.69,167.64
  Bottom 0.61: OK16.4 13.97,166.37 15.24,167.64 R33.1 v186.69,167.64 | IC1.30 196.85,73.66 198.12,74.93 v198.12,85.09 | v198.12,100.33 198.12,143.51 196.85,144.78 194.31,144.78 193.04,146.05 193.04,154.94 186.69,161.29 v186.69,162.56
IN16
  Bottom 0.61: OK17.4 44.45,163.83 45.72,165.1 R35.1 214.63,165.1 215.9,163.83 215.9,156.21 214.63,154.94 207.01,154.94 205.74,153.67 205.74,90.17 203.2,87.63 203.2,74.93 201.93,73.66 201.93,55.88 207.01,50.8 IC1.2
IN17  (via drill 0.6 pad 1.42)
  Top 0.254: v210.82,142.24 v195.58,142.24
  Bottom 0.61: OK18.4 74.93,161.29 76.2,162.56 R37.1 181.61,162.56 190.5,153.67 190.5,143.51 191.77,142.24 v195.58,142.24 | IC1.3 207.01,53.34 204.47,55.88 204.47,64.77 203.2,66.04 203.2,72.39 204.47,73.66 204.47,85.09 208.28,88.9 208.28,140.97 209.55,142.24 v210.82,142.24
IN18  (via drill 0.6 pad 1.42)
  Top 0.254: v210.82,139.7 v195.58,139.7
  Bottom 0.61: OK19.4 105.41,158.75 106.68,160.02 R39.1 180.34,160.02 187.96,152.4 187.96,142.24 190.5,139.7 v195.58,139.7 | IC1.4 227.33,55.88 229.87,58.42 229.87,104.14 228.6,105.41 215.9,105.41 213.36,107.95 213.36,137.16 v210.82,139.7
IN19  (via drill 0.6 pad 1.42)
  Top 0.254: v210.82,137.16 v195.58,137.16
  Bottom 0.61: OK20.4 135.89,154.94 137.16,153.67 144.78,153.67 148.59,157.48 R41.1 179.07,157.48 185.42,151.13 185.42,140.97 189.23,137.16 v195.58,137.16 | IC1.5 226.06,58.42 227.33,59.69 227.33,101.6 226.06,102.87 214.63,102.87 210.82,106.68 v210.82,137.16
MCLR
  Bottom 0.61: IC1.1 R1.1
N$1
  Bottom 0.813: OK1.1 R2.1
N$2
  Bottom 0.61: R4.1 44.45,24.13 OK2.1
N$3
  Bottom 0.61: R6.1 74.93,24.13 OK3.1
N$4
  Bottom 0.61: R8.1 105.41,24.13 OK4.1
N$5
  Bottom 0.61: R10.1 135.89,24.13 OK5.1
N$6
  Bottom 0.813: OK6.1 R12.1
N$7
  Bottom 0.61: R14.1 44.45,66.04 OK7.1
N$8
  Bottom 0.61: R16.1 74.93,66.04 OK8.1
N$9
  Bottom 0.61: R18.1 105.41,66.04 OK9.1
N$10
  Bottom 0.61: R20.1 135.89,66.04 OK10.1
N$11
  Bottom 0.813: R22.1 OK11.1
N$12
  Bottom 0.61: R24.1 44.45,107.95 OK12.1
N$13
  Bottom 0.61: R26.1 74.93,107.95 OK13.1
N$14
  Bottom 0.61: R28.1 135.89,107.95 OK14.1
N$15
  Bottom 0.61: R30.1 105.41,107.95 OK15.1
N$16
  Bottom 0.813: OK16.1 R32.1
N$17
  Bottom 0.61: R34.1 44.45,149.86 OK17.1
N$18
  Bottom 0.61: R36.1 74.93,149.86 OK18.1
N$19
  Bottom 0.61: R38.1 105.41,149.86 OK19.1
N$20
  Bottom 0.61: R40.1 135.89,149.86 OK20.1
N$21
  Bottom 0.813: IC2.1 SW1.1
N$22
  Bottom 0.813: IC2.2 SW1.2
N$23
  Bottom 0.813: IC2.3 SW1.3
N$24
  Bottom 0.813: IC2.4 SW1.4
N$25
  Bottom 0.813: IC2.6 25.4,17.78 SW1.5
N$26
  Bottom 0.813: C6.+ IC2.7 31.75,20.32 33.02,19.05 R42.2
N$27
  Bottom 0.813: IC2.8 R43.S 36.83,25.4 R43.A 39.37,24.13 43.18,20.32 43.18,19.05 40.64,16.51 C7.+
N$28
  Bottom 0.813: IC3.1 SW2.1
N$29
  Bottom 0.813: IC3.2 SW2.2
N$30
  Bottom 0.813: IC3.3 SW2.3
N$31
  Bottom 0.813: IC3.4 SW2.4
N$32
  Bottom 0.813: IC3.6 55.88,17.78 SW2.5
N$33
  Bottom 0.813: C8.+ IC3.7 62.23,20.32 63.5,19.05 R44.2
N$34
  Bottom 0.813: IC3.8 R45.S 67.31,25.4 R45.A 69.85,24.13 73.66,20.32 73.66,19.05 71.12,16.51 C9.+
N$35
  Bottom 0.813: IC4.1 SW3.1
N$36
  Bottom 0.813: SW3.2 IC4.2
N$37
  Bottom 0.813: IC4.3 SW3.3
N$38
  Bottom 0.813: IC4.4 SW3.4
N$39
  Bottom 0.813: IC4.6 86.36,17.78 SW3.5
N$40
  Bottom 0.813: C10.+ IC4.7 92.71,20.32 93.98,19.05 R46.2
N$41
  Bottom 0.813: IC4.8 R47.S 97.79,25.4 R47.A 100.33,24.13 104.14,20.32 104.14,19.05 101.6,16.51 C11.+
N$42
  Bottom 0.813: IC5.1 SW4.1
N$43
  Bottom 0.813: SW4.2 IC5.2
N$44
  Bottom 0.813: IC5.3 SW4.3
N$45
  Bottom 0.813: IC5.4 SW4.4
N$46
  Bottom 0.813: IC5.6 116.84,17.78 SW4.5
N$47
  Bottom 0.813: C12.+ IC5.7 123.19,20.32 124.46,19.05 R48.2
N$48
  Bottom 0.813: IC5.8 R49.S 128.27,25.4 R49.A 130.81,24.13 134.62,20.32 134.62,19.05 132.08,16.51 C13.+
N$49
  Bottom 0.813: IC6.1 SW5.1
N$50
  Bottom 0.813: IC6.2 SW5.2
N$51
  Bottom 0.813: IC6.3 SW5.3
N$52
  Bottom 0.813: IC6.4 SW5.4
N$53
  Bottom 0.813: IC6.6 147.32,17.78 SW5.5
N$54
  Bottom 0.813: C14.+ IC6.7 153.67,20.32 154.94,19.05 R50.2
N$55
  Bottom 0.813: IC6.8 R51.S 158.75,25.4 R51.A 161.29,24.13 165.1,20.32 165.1,19.05 162.56,16.51 C15.+
N$56
  Bottom 0.813: IC7.1 SW6.1
N$57
  Bottom 0.813: IC7.2 SW6.2
N$58
  Bottom 0.813: IC7.3 SW6.3
N$59
  Bottom 0.813: IC7.4 SW6.4
N$60
  Bottom 0.813: IC7.6 25.4,59.69 SW6.5
N$61
  Bottom 0.813: C16.+ IC7.7 31.75,62.23 33.02,60.96 R52.2
N$62
  Bottom 0.813: IC7.8 R53.S 36.83,67.31 R53.A 39.37,66.04 43.18,62.23 43.18,60.96 40.64,58.42 C17.+
N$63
  Bottom 0.813: IC8.1 SW7.1
N$64
  Bottom 0.813: IC8.2 SW7.2
N$65
  Bottom 0.813: IC8.3 SW7.3
N$66
  Bottom 0.813: IC8.4 SW7.4
N$67
  Bottom 0.813: IC8.6 55.88,59.69 SW7.5
N$68
  Bottom 0.813: C18.+ IC8.7 62.23,62.23 63.5,60.96 R54.2
N$69
  Bottom 0.813: IC8.8 R55.S 67.31,67.31 R55.A 69.85,66.04 73.66,62.23 73.66,60.96 71.12,58.42 C19.+
N$70
  Bottom 0.813: IC9.1 SW8.1
N$71
  Bottom 0.813: IC9.2 SW8.2
N$72
  Bottom 0.813: IC9.3 SW8.3
N$73
  Bottom 0.813: IC9.4 SW8.4
N$74
  Bottom 0.813: IC9.6 86.36,59.69 SW8.5
N$75
  Bottom 0.813: C20.+ IC9.7 92.71,62.23 93.98,60.96 R56.2
N$76
  Bottom 0.813: IC9.8 R57.S 97.79,67.31 R57.A 100.33,66.04 104.14,62.23 104.14,60.96 101.6,58.42 C21.+
N$77
  Bottom 0.813: IC10.1 SW9.1
N$78
  Bottom 0.813: IC10.2 SW9.2
N$79
  Bottom 0.813: IC10.3 SW9.3
N$80
  Bottom 0.813: IC10.4 SW9.4
N$81
  Bottom 0.813: IC10.6 116.84,59.69 SW9.5
N$82
  Bottom 0.813: C22.+ IC10.7 123.19,62.23 124.46,60.96 R58.2
N$83
  Bottom 0.813: IC10.8 R59.S 128.27,67.31 R59.A 130.81,66.04 134.62,62.23 134.62,60.96 132.08,58.42 C23.+
N$84
  Bottom 0.813: IC11.1 SW10.1
N$85
  Bottom 0.813: IC11.2 SW10.2
N$86
  Bottom 0.813: IC11.3 SW10.3
N$87
  Bottom 0.813: IC11.4 SW10.4
N$88
  Bottom 0.813: IC11.6 147.32,59.69 SW10.5
N$89
  Bottom 0.813: C24.+ IC11.7 153.67,62.23 154.94,60.96 R60.2
N$90
  Bottom 0.813: IC11.8 R61.S 158.75,67.31 R61.A 161.29,66.04 165.1,62.23 165.1,60.96 162.56,58.42 C25.+
N$91
  Bottom 0.813: IC12.1 SW11.1
N$92
  Bottom 0.813: IC12.2 SW11.2
N$93
  Bottom 0.813: IC12.3 SW11.3
N$94
  Bottom 0.813: IC12.4 SW11.4
N$95
  Bottom 0.813: IC12.6 25.4,101.6 SW11.5
N$96
  Bottom 0.813: C26.+ IC12.7 31.75,104.14 33.02,102.87 R62.2
N$97
  Bottom 0.813: IC12.8 R63.S 36.83,109.22 R63.A 39.37,107.95 43.18,104.14 43.18,102.87 40.64,100.33 C27.+
N$98
  Bottom 0.813: IC13.1 SW12.1
N$99
  Bottom 0.813: IC13.2 SW12.2
N$100
  Bottom 0.813: IC13.3 SW12.3
N$101
  Bottom 0.813: IC13.4 SW12.4
N$102
  Bottom 0.813: IC13.6 55.88,101.6 SW12.5
N$103
  Bottom 0.813: C28.+ IC13.7 62.23,104.14 63.5,102.87 R64.2
N$104
  Bottom 0.813: IC13.8 R65.S 67.31,109.22 R65.A 69.85,107.95 73.66,104.14 73.66,102.87 71.12,100.33 C29.+
N$105
  Bottom 0.813: IC14.1 SW13.1
N$106
  Bottom 0.813: IC14.2 SW13.2
N$107
  Bottom 0.813: IC14.3 SW13.3
N$108
  Bottom 0.813: IC14.4 SW13.4
N$109
  Bottom 0.813: IC14.6 86.36,101.6 SW13.5
N$110
  Bottom 0.813: C30.+ IC14.7 92.71,104.14 93.98,102.87 R66.2
N$111
  Bottom 0.813: IC14.8 R67.S 97.79,109.22 R67.A 100.33,107.95 104.14,104.14 104.14,102.87 101.6,100.33 C31.+
N$112
  Bottom 0.813: IC15.1 SW14.1
N$113
  Bottom 0.813: IC15.2 SW14.2
N$114
  Bottom 0.813: IC15.3 SW14.3
N$115
  Bottom 0.813: IC15.4 SW14.4
N$116
  Bottom 0.813: IC15.6 116.84,101.6 SW14.5
N$117
  Bottom 0.813: C32.+ IC15.7 123.19,104.14 124.46,102.87 R68.2
N$118
  Bottom 0.813: IC15.8 R69.S 128.27,109.22 R69.A 130.81,107.95 134.62,104.14 134.62,102.87 132.08,100.33 C33.+
N$119
  Bottom 0.813: IC16.1 SW15.1
N$120
  Bottom 0.813: IC16.2 SW15.2
N$121
  Bottom 0.813: IC16.3 SW15.3
N$122
  Bottom 0.813: IC16.4 SW15.4
N$123
  Bottom 0.813: IC16.6 147.32,101.6 SW15.5
N$124
  Bottom 0.813: C34.+ IC16.7 153.67,104.14 154.94,102.87 R70.2
N$125
  Bottom 0.813: IC16.8 R71.S 158.75,109.22 R71.A 161.29,107.95 165.1,104.14 165.1,102.87 162.56,100.33 C35.+
N$126
  Bottom 0.813: IC17.1 SW16.1
N$127
  Bottom 0.813: IC17.2 SW16.2
N$128
  Bottom 0.813: IC17.3 SW16.3
N$129
  Bottom 0.813: IC17.4 SW16.4
N$130
  Bottom 0.813: IC17.6 25.4,143.51 SW16.5
N$131
  Bottom 0.813: C36.+ IC17.7 31.75,146.05 33.02,144.78 R72.2
N$132
  Bottom 0.813: IC17.8 R73.S 36.83,151.13 R73.A 39.37,149.86 43.18,146.05 43.18,144.78 40.64,142.24 C37.+
N$133
  Bottom 0.813: IC18.1 SW17.1
N$134
  Bottom 0.813: IC18.2 SW17.2
N$135
  Bottom 0.813: IC18.3 SW17.3
N$136
  Bottom 0.813: IC18.4 SW17.4
N$137
  Bottom 0.813: IC18.6 55.88,143.51 SW17.5
N$138
  Bottom 0.813: C38.+ IC18.7 62.23,146.05 63.5,144.78 R74.2
N$139
  Bottom 0.813: IC18.8 R75.S 67.31,151.13 R75.A 69.85,149.86 73.66,146.05 73.66,144.78 71.12,142.24 C39.+
N$140
  Bottom 0.813: SW18.1 IC19.1
N$141
  Bottom 0.813: IC19.2 SW18.2
N$142
  Bottom 0.813: SW18.3 IC19.3
N$143
  Bottom 0.813: IC19.4 SW18.4
N$144
  Bottom 0.813: IC19.6 86.36,143.51 SW18.5
N$145
  Bottom 0.813: C40.+ IC19.7 92.71,146.05 93.98,144.78 R76.2
N$146
  Bottom 0.813: IC19.8 R77.S 97.79,151.13 R77.A 100.33,149.86 104.14,146.05 104.14,144.78 101.6,142.24 C41.+
N$147
  Bottom 0.813: IC20.1 SW19.1
N$148
  Bottom 0.813: IC20.2 SW19.2
N$149
  Bottom 0.813: IC20.3 SW19.3
N$150
  Bottom 0.813: IC20.4 SW19.4
N$151
  Bottom 0.813: IC20.6 116.84,143.51 SW19.5
N$152
  Bottom 0.813: C42.+ IC20.7 123.19,146.05 124.46,144.78 R78.2
N$153
  Bottom 0.813: IC20.8 R79.S 128.27,151.13 R79.A 130.81,149.86 134.62,146.05 134.62,144.78 132.08,142.24 C43.+
N$154
  Bottom 0.813: IC21.1 SW20.1
N$155
  Bottom 0.813: IC21.2 SW20.2
N$156
  Bottom 0.813: IC21.3 SW20.3
N$157
  Bottom 0.813: IC21.4 SW20.4
N$158
  Bottom 0.813: IC21.6 147.32,143.51 SW20.5
N$159
  Bottom 0.813: C44.+ IC21.7 153.67,146.05 154.94,144.78 R80.2
N$160
  Bottom 0.813: IC21.8 R81.S 158.75,151.13 R81.A 161.29,149.86 165.1,146.05 165.1,144.78 162.56,142.24 C45.+
N$161
  Bottom 1.27: J1.3 D1.A
N$162
  Bottom 0.813: 212.09,11.43 C46.+ | 203.2,15.24 C47.1
  Bottom 1.27: D1.C 212.09,11.43 | C46.+ 207.01,11.43 203.2,15.24 | C47.1 195.58,15.24 IC22.1
N$163
  Bottom 0.813: J1.1 223.06,8.43 | 190.5,11.43 IC22.2
  Bottom 1.27: 223.06,8.43 220.98,6.35 C46.- 201.93,6.35 C47.2 194.31,7.62 190.5,11.43 | R82.2 IC22.2
N$164
  Bottom 0.813: LED1.A JP1.1
N$165
  Bottom 0.813: JP1.2 R83.1
OSC1
  Bottom 0.61: IC1.13 215.77,78.74 Q1.1 216.03,78.74 C4.1
OSC2
  Bottom 0.61: IC1.14 214.63,81.28 215.9,82.55 Q1.2 216.03,83.82 C5.1
SEN0
  Bottom 0.813: C7.- 38.1,7.62 PAD2.1
SEN1
  Bottom 0.813: C9.- 68.58,7.62 PAD3.1
SEN2
  Bottom 0.813: C11.- 99.06,7.62 PAD4.1
SEN3
  Bottom 0.813: C13.- 129.54,7.62 PAD5.1
SEN4
  Bottom 0.813: C15.- 160.02,7.62 PAD6.1
SEN5
  Bottom 0.813: C17.- 38.1,49.53 PAD7.1
SEN6
  Bottom 0.813: C19.- 68.58,49.53 PAD8.1
SEN7
  Bottom 0.813: C21.- 99.06,49.53 PAD9.1
SEN8
  Bottom 0.813: C23.- 129.54,49.53 PAD10.1
SEN9
  Bottom 0.813: C25.- 160.02,49.53 PAD11.1
SEN10
  Bottom 0.813: C27.- 38.1,91.44 PAD13.1
SEN11
  Bottom 0.813: C29.- 68.58,91.44 PAD12.1
SEN12
  Bottom 0.813: C31.- 99.06,91.44 PAD15.1
SEN13
  Bottom 0.813: C35.- 160.02,91.44 PAD14.1
SEN14
  Bottom 0.813: C33.- 129.54,91.44 PAD16.1
SEN15
  Bottom 0.813: C37.- 38.1,133.35 PAD17.1
SEN16
  Bottom 0.813: C39.- 68.58,133.35 PAD19.1
SEN17
  Bottom 0.813: C41.- 99.06,133.35 PAD18.1
SEN18
  Bottom 0.813: C43.- 129.54,133.35 PAD20.1
SEN19
  Bottom 0.813: C45.- 160.02,133.35 PAD21.1
VAL0
  Bottom 0.813: SW1.10 SW1.9 SW1.8 SW1.7 SW1.6 15.24,19.05 16.51,20.32 OK1.2
VAL1
  Bottom 0.813: SW2.10 SW2.9 SW2.8 SW2.7 SW2.6 45.72,19.05 46.99,20.32 OK2.2
VAL2
  Bottom 0.813: SW3.10 SW3.9 SW3.8 SW3.7 SW3.6 76.2,19.05 77.47,20.32 OK3.2
VAL3
  Bottom 0.813: SW4.10 SW4.9 SW4.8 SW4.7 SW4.6 106.68,19.05 107.95,20.32 OK4.2
VAL4
  Bottom 0.813: SW5.10 SW5.9 SW5.8 SW5.7 SW5.6 137.16,19.05 138.43,20.32 OK5.2
VAL5
  Bottom 0.813: SW6.10 SW6.9 SW6.8 SW6.7 SW6.6 15.24,60.96 16.51,62.23 OK6.2
VAL6
  Bottom 0.813: SW7.10 SW7.9 SW7.8 SW7.7 SW7.6 45.72,60.96 46.99,62.23 OK7.2
VAL7
  Bottom 0.813: SW8.10 SW8.9 SW8.8 SW8.7 SW8.6 76.2,60.96 77.47,62.23 OK8.2
VAL8
  Bottom 0.813: SW9.10 SW9.9 SW9.8 SW9.7 SW9.6 106.68,60.96 107.95,62.23 OK9.2
VAL9
  Bottom 0.813: SW10.10 SW10.9 SW10.8 SW10.7 SW10.6 137.16,60.96 138.43,62.23 OK10.2
VAL10
  Bottom 0.813: SW11.10 SW11.9 SW11.8 SW11.7 SW11.6 15.24,102.87 16.51,104.14 OK11.2
VAL11
  Bottom 0.813: SW12.10 SW12.9 SW12.8 SW12.7 SW12.6 45.72,102.87 46.99,104.14 OK12.2
VAL12
  Bottom 0.813: SW13.10 SW13.9 SW13.8 SW13.7 SW13.6 76.2,102.87 77.47,104.14 OK13.2
VAL13
  Bottom 0.813: SW15.10 SW15.9 SW15.8 SW15.7 SW15.6 137.16,102.87 138.43,104.14 OK14.2
VAL14
  Bottom 0.813: SW14.10 SW14.9 SW14.8 SW14.7 SW14.6 106.68,102.87 107.95,104.14 OK15.2
VAL15
  Bottom 0.813: SW16.10 SW16.9 SW16.8 SW16.7 SW16.6 15.24,144.78 16.51,146.05 OK16.2
VAL16
  Bottom 0.813: SW17.10 SW17.9 SW17.8 SW17.7 SW17.6 45.72,144.78 46.99,146.05 OK17.2
VAL17
  Bottom 0.813: SW18.10 SW18.9 SW18.8 SW18.7 SW18.6 76.2,144.78 77.47,146.05 OK18.2
VAL18
  Bottom 0.813: SW19.10 SW19.9 SW19.8 SW19.7 SW19.6 106.68,144.78 107.95,146.05 OK19.2
VAL19
  Bottom 0.813: SW20.10 SW20.9 SW20.8 SW20.7 SW20.6 137.16,144.78 138.43,146.05 OK20.2
VUSB
  Bottom 0.61: C1.1 IC1.18